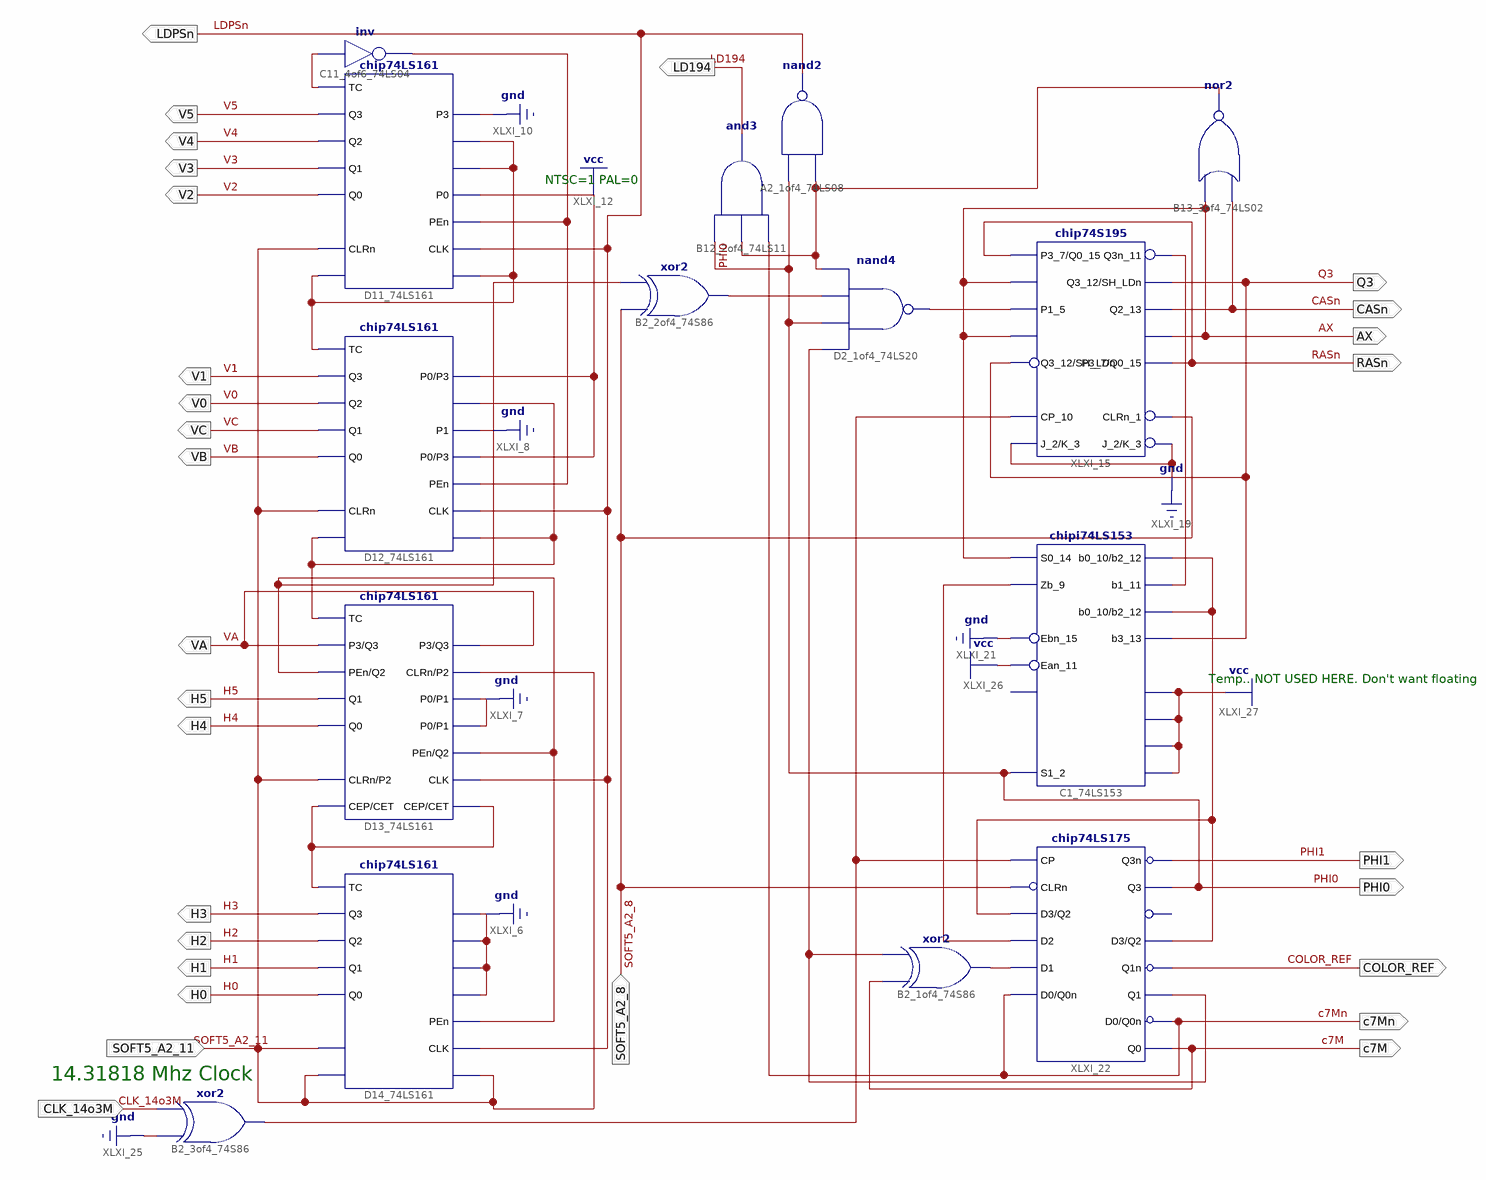
[diagram p0: schematic sheet 1]
// Xilinx ISE schematic ClockVideoGenerator.sch (spartan3e) as structural Verilog: 15 symbols, 29 ports
module ClockVideoGenerator (
  input  SOFT5_A2_11,
  input  SOFT5_A2_8,
  input  CLK_14o3M,
  output VA,
  output V5,
  output V4,
  output V3,
  output V2,
  output V1,
  output V0,
  output VC,
  output VB,
  output H5,
  output H4,
  output H3,
  output H2,
  output H1,
  output H0,
  output RASn,
  output CASn,
  output AX,
  output Q3,
  output LDPSn,
  output LD194,
  output PHI0,
  output PHI1,
  output COLOR_REF,
  output c7M,
  output c7Mn
);

  wire XLXN_1, XLXN_3, XLXN_4, XLXN_5, XLXN_6, XLXN_10, XLXN_35, XLXN_36, XLXN_46, XLXN_54, XLXN_62, XLXN_64,
       XLXN_72, XLXN_76, XLXN_87;

  chip74LS161 D14_74LS161 (
    .CEP(SOFT5_A2_11), .CET(SOFT5_A2_11), .CLK(LDPSn), .CLRn(SOFT5_A2_11), .P0(1'b0), .P1(1'b0), .P2(1'b0),
    .P3(1'b0), .PEn(XLXN_10), .Q0(H0), .Q1(H1), .Q2(H2), .Q3(H3), .TC(XLXN_1));
  chip74LS161 D13_74LS161 (
    .CEP(XLXN_1), .CET(XLXN_1), .CLK(LDPSn), .CLRn(SOFT5_A2_11), .P0(1'b0), .P1(1'b0), .P2(SOFT5_A2_11),
    .P3(VA), .PEn(XLXN_10), .Q0(H4), .Q1(H5), .Q2(XLXN_10), .Q3(VA), .TC(XLXN_3));
  chip74LS161 D12_74LS161 (
    .CEP(XLXN_3), .CET(XLXN_3), .CLK(LDPSn), .CLRn(SOFT5_A2_11), .P0(1'b1), .P1(1'b0), .P2(XLXN_3),
    .P3(1'b1), .PEn(XLXN_6), .Q0(VB), .Q1(VC), .Q2(V0), .Q3(V1), .TC(XLXN_4));
  chip74LS161 D11_74LS161 (
    .CEP(XLXN_4), .CET(XLXN_4), .CLK(LDPSn), .CLRn(SOFT5_A2_11), .P0(1'b1), .P1(XLXN_4), .P2(XLXN_4),
    .P3(1'b0), .PEn(XLXN_6), .Q0(V2), .Q1(V3), .Q2(V4), .Q3(V5), .TC(XLXN_5));
  not C11_4of6_74LS04 (XLXN_6, XLXN_5);
  xor B2_2of4_74S86 (XLXN_35, SOFT5_A2_8, XLXN_10);
  nand D2_1of4_74LS20 (XLXN_36, XLXN_87, PHI0, XLXN_35, XLXN_46);
  chip74S195 XLXI_15 (
    .CLRn_1(SOFT5_A2_8), .CP_10(XLXN_76), .J_2(1'b0), .K_3(1'b0), .P0_4(AX), .P1_5(XLXN_36), .P2_6(AX),
    .P3_7(RASn), .Q0_15(RASn), .Q1_14(AX), .Q2_13(CASn), .Q3n_11(XLXN_54), .Q3_12(Q3), .SH_LDn(Q3));
  nand A2_1of4_74LS08 (LDPSn, XLXN_46, PHI0);
  and B12_2of4_74LS11 (LD194, c7Mn, XLXN_46, PHI0);
  nor B13_3of4_74LS02 (XLXN_46, CASn, AX);
  chipi74LS153 C1_74LS153 (
    .a0_6(1'b1), .a1_5(1'b1), .a2_4(1'b1), .a3_3(1'b1), .b0_10(XLXN_62), .b1_11(XLXN_54), .b2_12(XLXN_62),
    .b3_13(Q3), .Ean_11(1'b1), .Ebn_15(1'b0), .S0_14(AX), .S1_2(PHI0), .Zb_9(XLXN_72));  // open: Za_7
  chip74LS175 XLXI_22 (
    .CLRn(SOFT5_A2_8), .CP(XLXN_76), .D0(c7Mn), .D1(XLXN_64), .D2(XLXN_72), .D3(XLXN_62), .Q0(c7M),
    .Q0n(c7Mn), .Q1(XLXN_87), .Q1n(COLOR_REF), .Q2(XLXN_62), .Q3(PHI0), .Q3n(PHI1));  // open: Q2n
  xor B2_1of4_74S86 (XLXN_64, c7M, XLXN_87);
  xor B2_3of4_74S86 (XLXN_76, 1'b0, CLK_14o3M);

  // Notes on the sheet:
  //   NTSC=1 PAL=0
  //   Temp.. NOT USED HERE. Don't want floating
  //   14.31818 Mhz Clock
endmodule
